# EAGLE design mdriver_8231A (EAGLE 9.6.2)
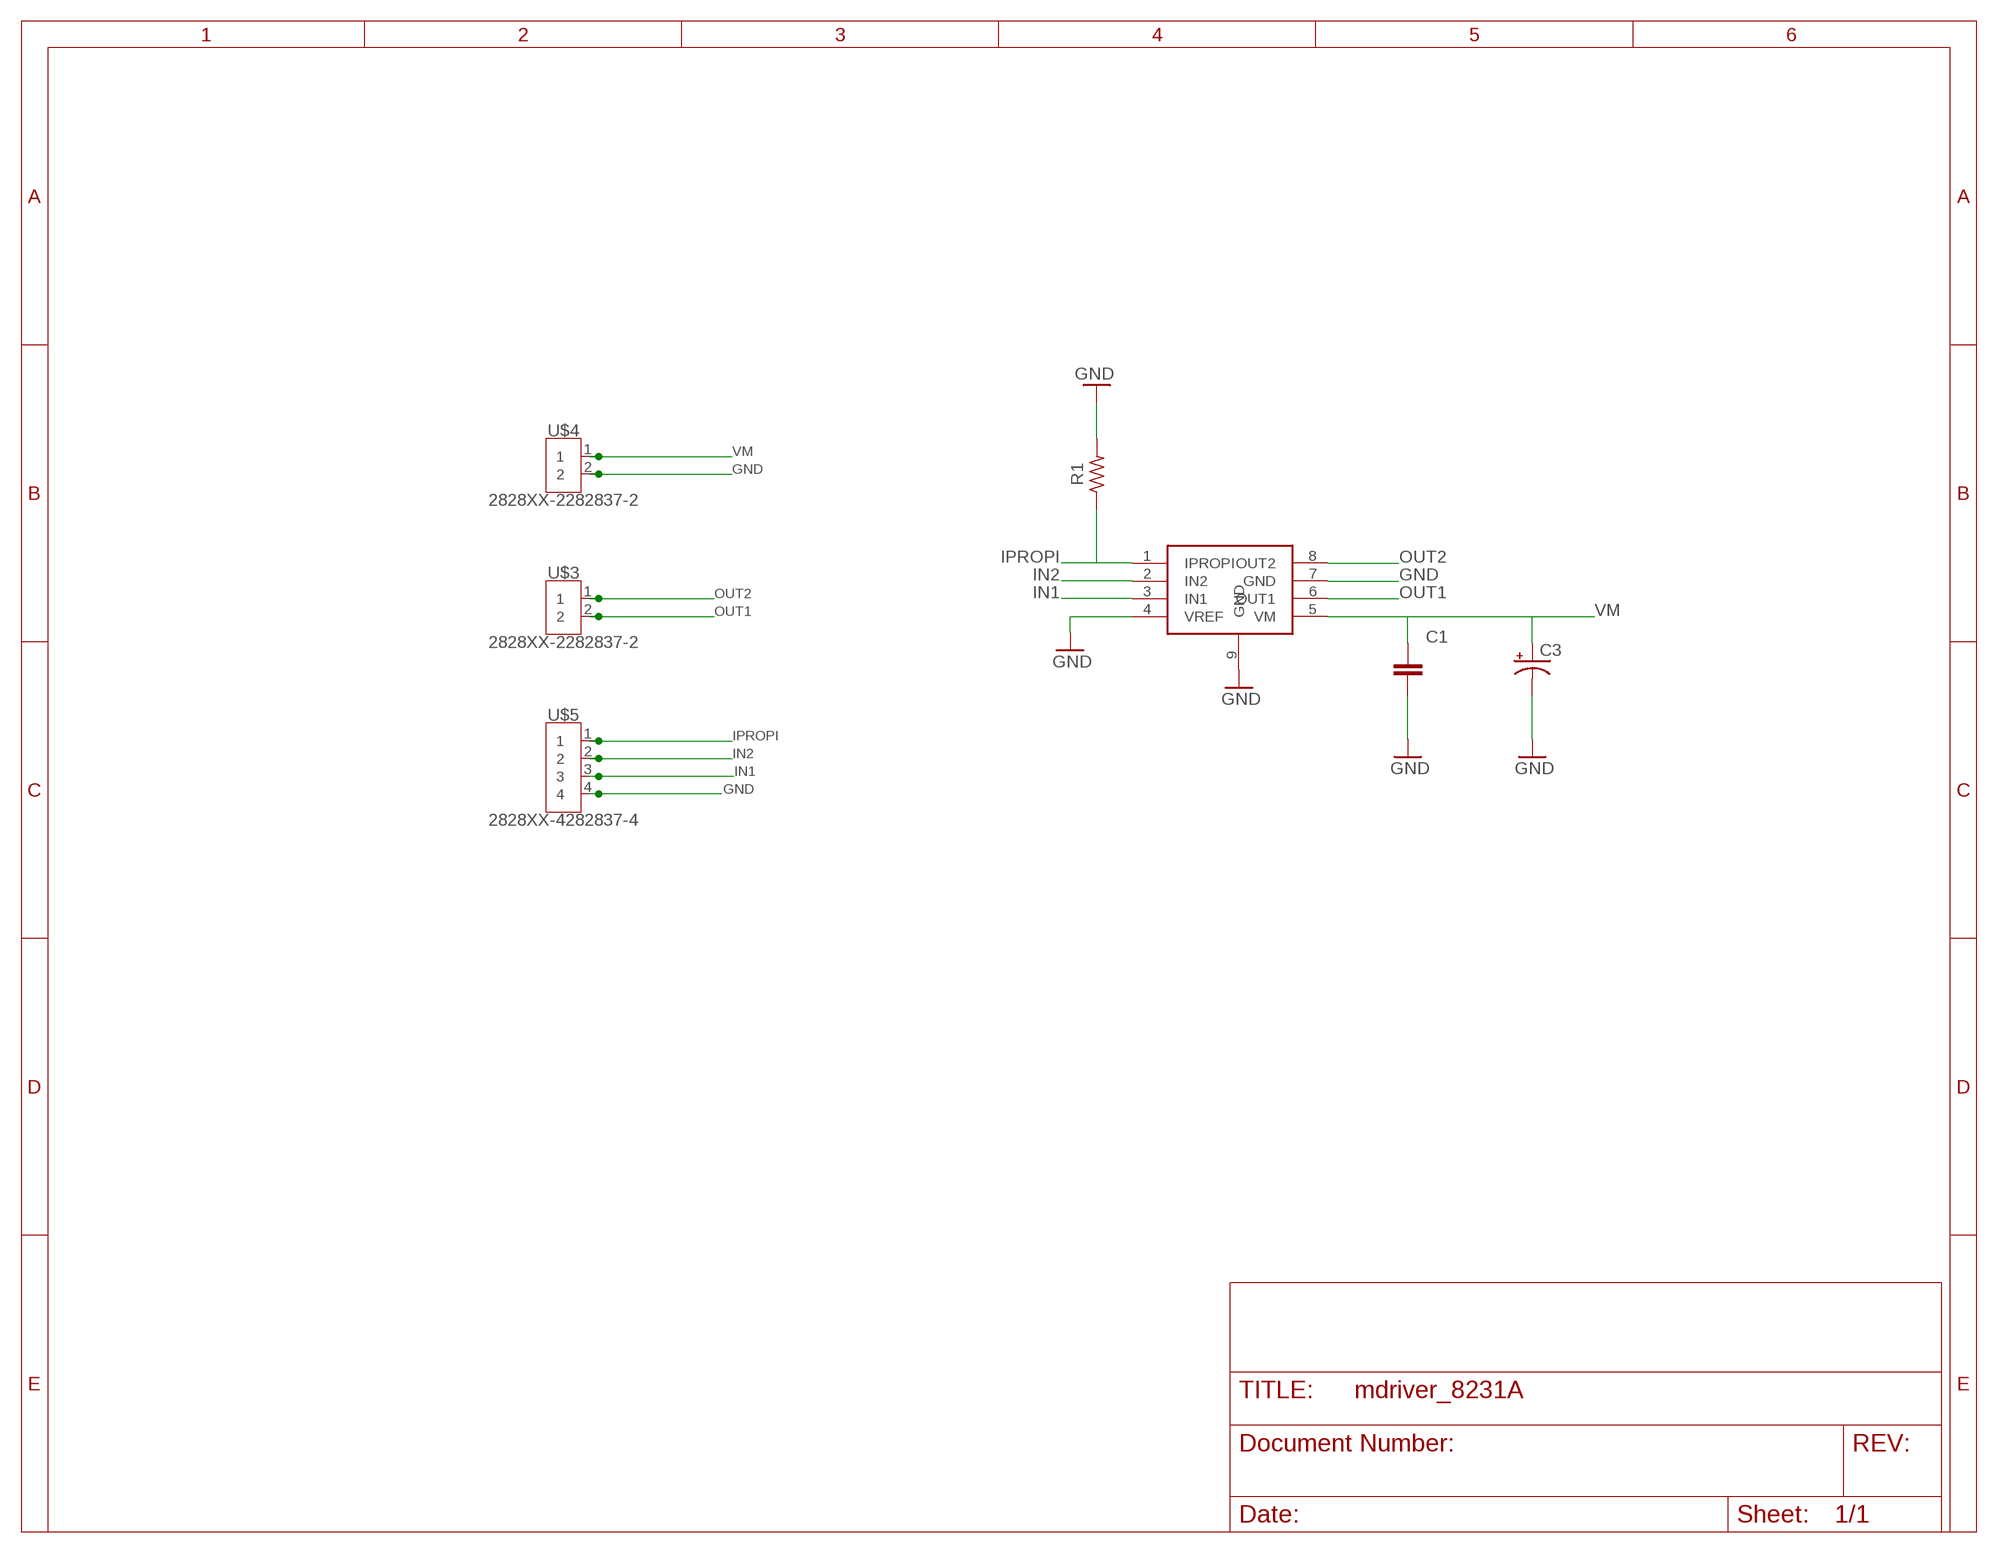
[diagram p0: schematic, sheet 1]

## Parts
C1  C_CHIP-1206(3216-METRIC)  [CAPC3216X135]
C3  C-POL-US_ECAP-10.5MM  [CAPAE1030X1050N]
R1  R-US_CHIP-0603(1608-METRIC)  [RESC1608X60]
U$1  DRV8231A  [SOIC127P580X170-9T271X340N]
U$3  2828XX-2282837-2  [TERMBLK_508-2N]
U$4  2828XX-2282837-2  [TERMBLK_508-2N]
U$5  2828XX-4282837-4  [TERMBLK_508-4N]

## Nets
GND: C1.2 C3.2(-) R1.2 U$1.4(VREF) U$1.7(GND) U$1.9(GND) U$4.2 U$5.4
IN1: U$1.3(IN1) U$5.3
IN2: U$1.2(IN2) U$5.2
IPROPI: R1.1 U$1.1(IPROPI) U$5.1
OUT1: U$1.6(OUT1) U$3.2
OUT2: U$1.8(OUT2) U$3.1
VM: C1.1 C3.1(+) U$1.5(VM) U$4.1

## Library data of the parts
C1 = Capacitor:C: Capacitor - Generic; CATEGORY: Capacitor
C3 = Capacitor:C-POL-US: Capacitor Polarised - ANSI; CATEGORY: Capacitor
R1 = Resistor:R-US: Resistor Fixed - ANSI; CATEGORY: Resistor; SUB-CATEGORY: Fixed
U$1 = pcb_moible:DRV8231A
U$3 U$4 = Connector:2828XX-2: 2 Position Wire to Board Terminal Block Horizontal with Board Datasheet <https://www.te.com.cn/commerce/DocumentDelivery/DDEController?Action=showdoc&DocId=Catalog+Section%7F1308389_EUROSTYLE_TERMINAL_BLOCKS%7F0607%7Fpdf%7FEnglish%7FENG_CS_1308389_EUROSTYLE_TERMINAL_BLOCKS_0607.pdf%7F2-282837-5>; CATEGORY: Connector; DESCRIPTION: 2 Position Wire to Board Terminal Block Horizontal with Board 5.08 mm Through Hole; MANUFACTURER: TE Connectivity; MPN: 282837-2; OPERATING_TEMPERATURE: -40°C to +105°C; PART_STATUS: ACTIVE; ROHS_COMPLIANCE: RoHS Compliant; SERIES: 282837; SUBCATEGORY: Terminal Block; TYPE: Side Wire Entry
U$5 = Connector:2828XX-4: 4 Position Wire to Board Terminal Block Horizontal with Board Datasheet <https://www.te.com.cn/commerce/DocumentDelivery/DDEController?Action=showdoc&DocId=Catalog+Section%7F1308389_EUROSTYLE_TERMINAL_BLOCKS%7F0607%7Fpdf%7FEnglish%7FENG_CS_1308389_EUROSTYLE_TERMINAL_BLOCKS_0607.pdf%7F2-282837-5>; CATEGORY: Connector; DESCRIPTION: TERM BLK 4P SIDE ENT 5.08mm PCB; MANUFACTURER: TE Connectivity; MPN: 282837-4; OPERATING_TEMPERATURE: 40°C to +105°C; PART_STATUS: Active; ROHS_COMPLIANCE: RoHS Compliant; SERIES: 283737; SUBCATEGORY: Terminal Block; TYPE: Side Wire Entry

## Board
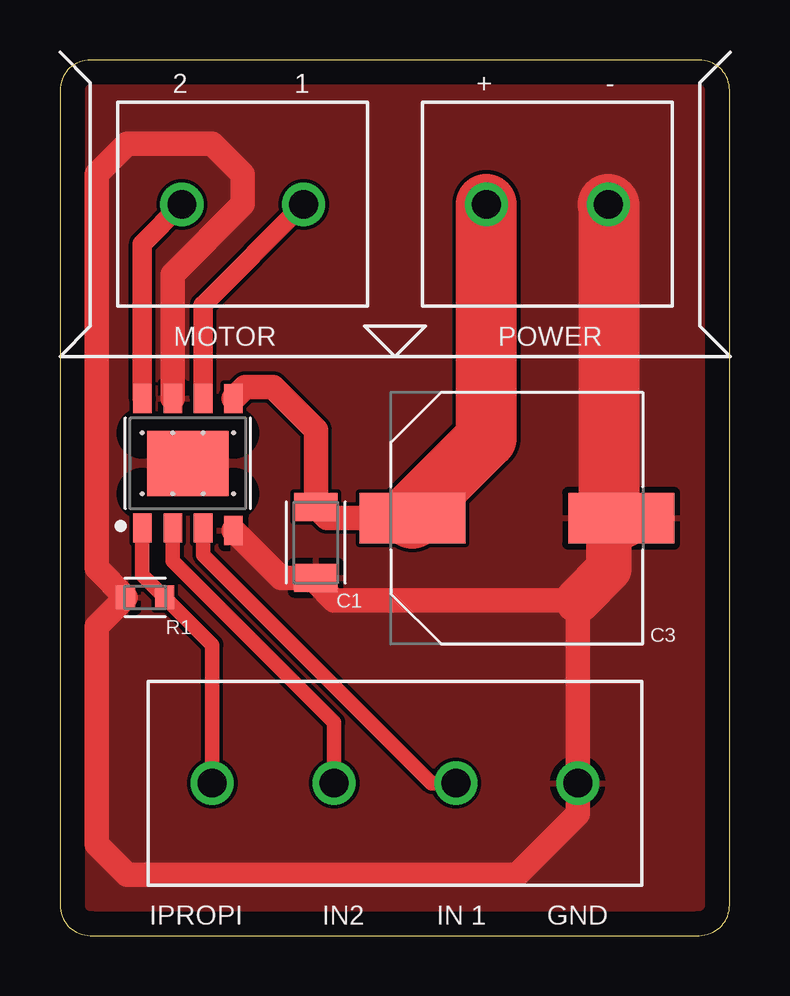
[diagram p1: board, top side]
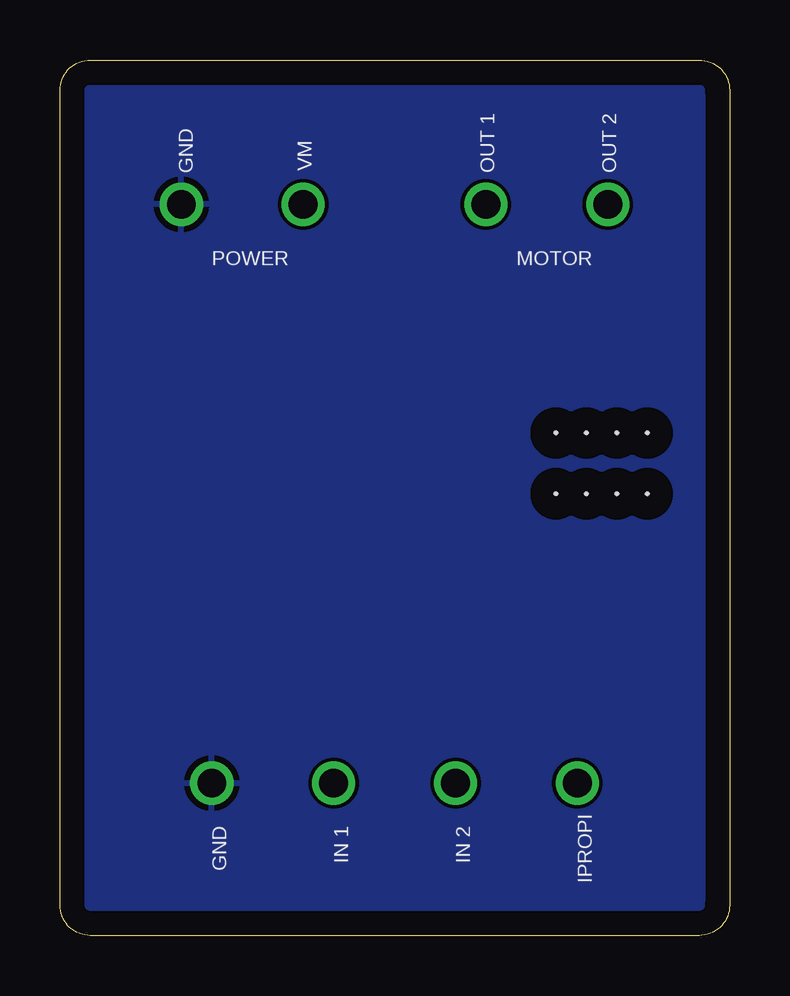
[diagram p2: board, bottom side, seen from below]

Size 27.92 x 36.5 mm. Coordinates in mm from the lower left corner, seen from the top.
Outline: 0,35.23 0,1.27 arc90 1.27,0 26.65,0 arc90 27.92,1.27 27.92,35.23 arc90 26.65,36.5 1.27,36.5 arc90 0,35.23
Copper layers (1*16): Top 0.035mm / dielectric 1.5mm / Bottom 0.035mm
Design rules "default": minimum track width 6mil, minimum drill 0.35mm, track to track 6mil, track to pad 6mil, pad to pad 6mil, via to via 6mil, smd to smd 6mil, copper to edge 40mil, drill to drill 6mil, minimum pad ring 10mil, minimum via ring 8mil, stop-mask expansion 4mil, vias tented up to drill 0mil, thermal gap 10mil
Holes 0.1 mm at 3.43,20.95 4.7,20.95 5.97,20.95 7.24,20.95 7.24,18.41 5.97,18.41 4.7,18.41 3.43,18.41

### Footprints (pad centres in the part's own frame; a part is rotated, then mirrored left to right if it is on the bottom)
CAPC3216X135 = smd 1.165 x 1.815: 1 -1.475,0; 2 1.475,0
CAPAE1030X1050N = smd 4.416 x 2.115: 1 -4.353,0; 2 4.353,0
RESC1608X60 = smd 0.799 x 0.974: 1 -0.815,0; 2 0.815,0
SOIC127P580X170-9T271X340N = smd 1.212 x 0.772: 1 -2.7,1.905; 2 -2.7,0.635; 3 -2.7,-0.635; 4 -2.8,-1.905; 5 2.7,-1.905; 6 2.7,-0.635; 7 2.7,0.635; 8 2.7,1.905 | smd 2.71 x 3.4: 9 0,0
TERMBLK_508-2N = drill 1.2: 1 0,0; 2 5.08,0
TERMBLK_508-4N = drill 1.2: 1 0,0; 2 5.08,0; 3 10.16,0; 4 15.24,0

### Placement (x,y rotation side)
C1  10.67,16.38 270 top
C3  19.05,17.4 0 top
R1  3.56,14.1 180 top
U$1  5.33,19.68 90 top
U$3  5.08,30.48 0 top
U$4  17.78,30.48 0 top
U$5  6.35,6.35 0 top

### Tracks (layer width: path | path; a pad name or v marks a point on that pad's centre or on a via)
GND
  Top 1.016: U$1.7 4.7,27.56 7.62,30.48 7.62,31.75 6.35,33.02 2.79,33.02 1.52,31.75 1.52,15.31 R1.2 1.52,12.88 1.52,3.81 2.79,2.54 19.05,2.54 21.59,5.08 U$5.4 21.59,13.97 11.43,13.97 10.67,14.73 C1.2 9.22,14.91 U$1.4
  Top 1.905: 21.59,13.97 22.89,15.28 22.89,16.89 C3.2
  Top 2.54: C3.2 22.89,17.91 22.89,30.45 U$4.2
  pour Top: -7.62,41.91 38.1,41.91 38.1,-7.62 -8.89,-7.62 -8.89,41.91
  pour Bottom: -10.16,43.18 39.37,43.18 39.37,-8.89 -10.16,-8.89
IN1
  Top 0.61: U$1.3 5.97,15.88 15.49,6.35 U$5.3
IN2
  Top 0.61: U$1.2 4.7,15.62 11.43,8.89 U$5.2
IPROPI
  Top 0.61: U$1.1 3.43,15.04 R1.1 6.35,12.12 U$5.1
OUT1
  Top 0.813: U$1.6 5.97,26.29 U$3.2
OUT2
  Top 0.813: U$1.8 3.43,28.83 U$3.1
VM
  Top 1.016: C3.1 11.13,17.4 C1.1 10.67,21.08 8.89,22.86 7.71,22.86 U$1.5
  Top 2.54: C3.1 14.7,17.65 17.78,20.74 U$4.1

### Text on the board
tPlace: 2 | 1 | + | - | MOTOR | POWER | IPROPI | IN2 | IN 1 | GND
bPlace: OUT 2 | OUT 1 | GND | VM | MOTOR | POWER | IPROPI | IN 2 | IN 1 | GND